# EasyEDA schematic SCH_Ethernet_Based_PCB_Desiging_2026-05-02.json
TITLE: Sheet_1; REV: 1.0; Date: 2025-12-01; Sheet: 1/1; Drawn By: RAHBER; Company: Your Company
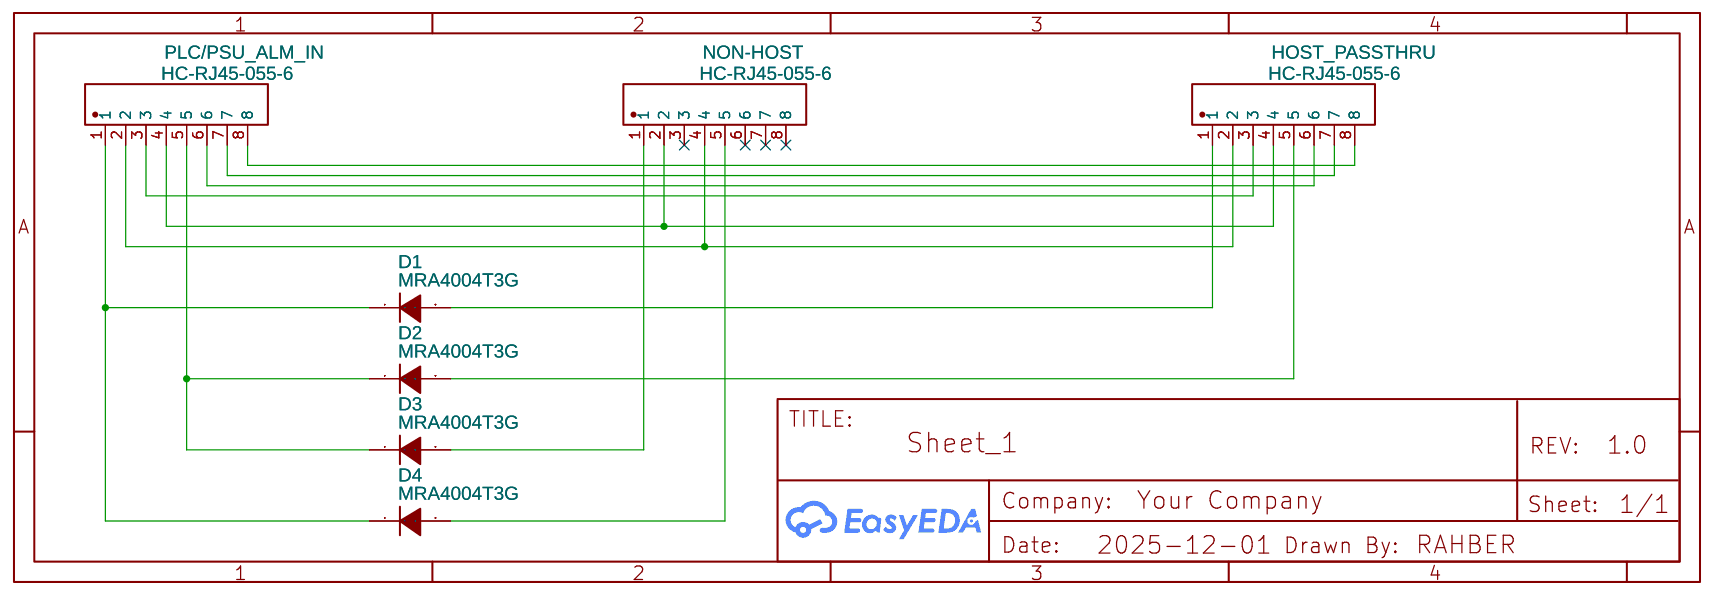
[diagram p0: schematic sheet]

## Parts
D1  MRA4004T3G  [SMA_L4.4-W2.8-LS5.4-RD]
D2  MRA4004T3G  [SMA_L4.4-W2.8-LS5.4-RD]
D3  MRA4004T3G  [SMA_L4.4-W2.8-LS5.4-RD]
D4  MRA4004T3G  [SMA_L4.4-W2.8-LS5.4-RD]
HOST_PASSTHRU  HC-RJ45-055-6  [RJ45-SMD_HC-RJ45-055-6]
NON-HOST  HC-RJ45-055-6  [RJ45-SMD_HC-RJ45-055-6]
PLC/PSU_ALM_IN  HC-RJ45-055-6  [RJ45-SMD_HC-RJ45-055-6]

## Library data of the parts
D1-D4 = MRA4004T3G: Supplier: LCSC; Manufacturer: onsemi(安森美); Supplier Part: C40324; JLCPCB Part Class: Extended Part
HOST_PASSTHRU NON-HOST PLC/PSU_ALM_IN = HC-RJ45-055-6: Contributor: lcsc; Supplier: LCSC; Supplier Part: C3000212; Manufacturer: HCTL(华灿天禄); JLCPCB Part Class: Extended Part

## Nets
Net-(D1-1): D1.1(-) D4.1(-) PLC/PSU_ALM_IN.1
Net-(D1-2): D1.2(+) HOST_PASSTHRU.1
Net-(D2-1): D2.1(-) D3.1(-) PLC/PSU_ALM_IN.5
Net-(D2-2): D2.2(+) HOST_PASSTHRU.5
Net-(D3-2): D3.2(+) NON-HOST.1
Net-(D4-2): D4.2(+) NON-HOST.5
Net-(HOST_PASSTHRU-2): HOST_PASSTHRU.2 NON-HOST.4 PLC/PSU_ALM_IN.2
Net-(HOST_PASSTHRU-3): HOST_PASSTHRU.3 PLC/PSU_ALM_IN.3
Net-(HOST_PASSTHRU-4): HOST_PASSTHRU.4 NON-HOST.2 PLC/PSU_ALM_IN.4
Net-(HOST_PASSTHRU-6): HOST_PASSTHRU.6 PLC/PSU_ALM_IN.6
Net-(HOST_PASSTHRU-7): HOST_PASSTHRU.7 PLC/PSU_ALM_IN.7
Net-(HOST_PASSTHRU-8): HOST_PASSTHRU.8 PLC/PSU_ALM_IN.8

Not connected (* = marked no-connect by the designer): NON-HOST 3* 6* 7* 8*
